# EasyEDA Pro project Влади-проект.eprj

# Schematic Schematic1
Board Name: Board1; Create Date: 2025-12-05; Page Name: P1; Project Name: Влади-проект; Schematic Name: Schematic1; Update Date: 2025-12-05; Company: EasyEDA.com; Page Size: A4; Version: V1.0
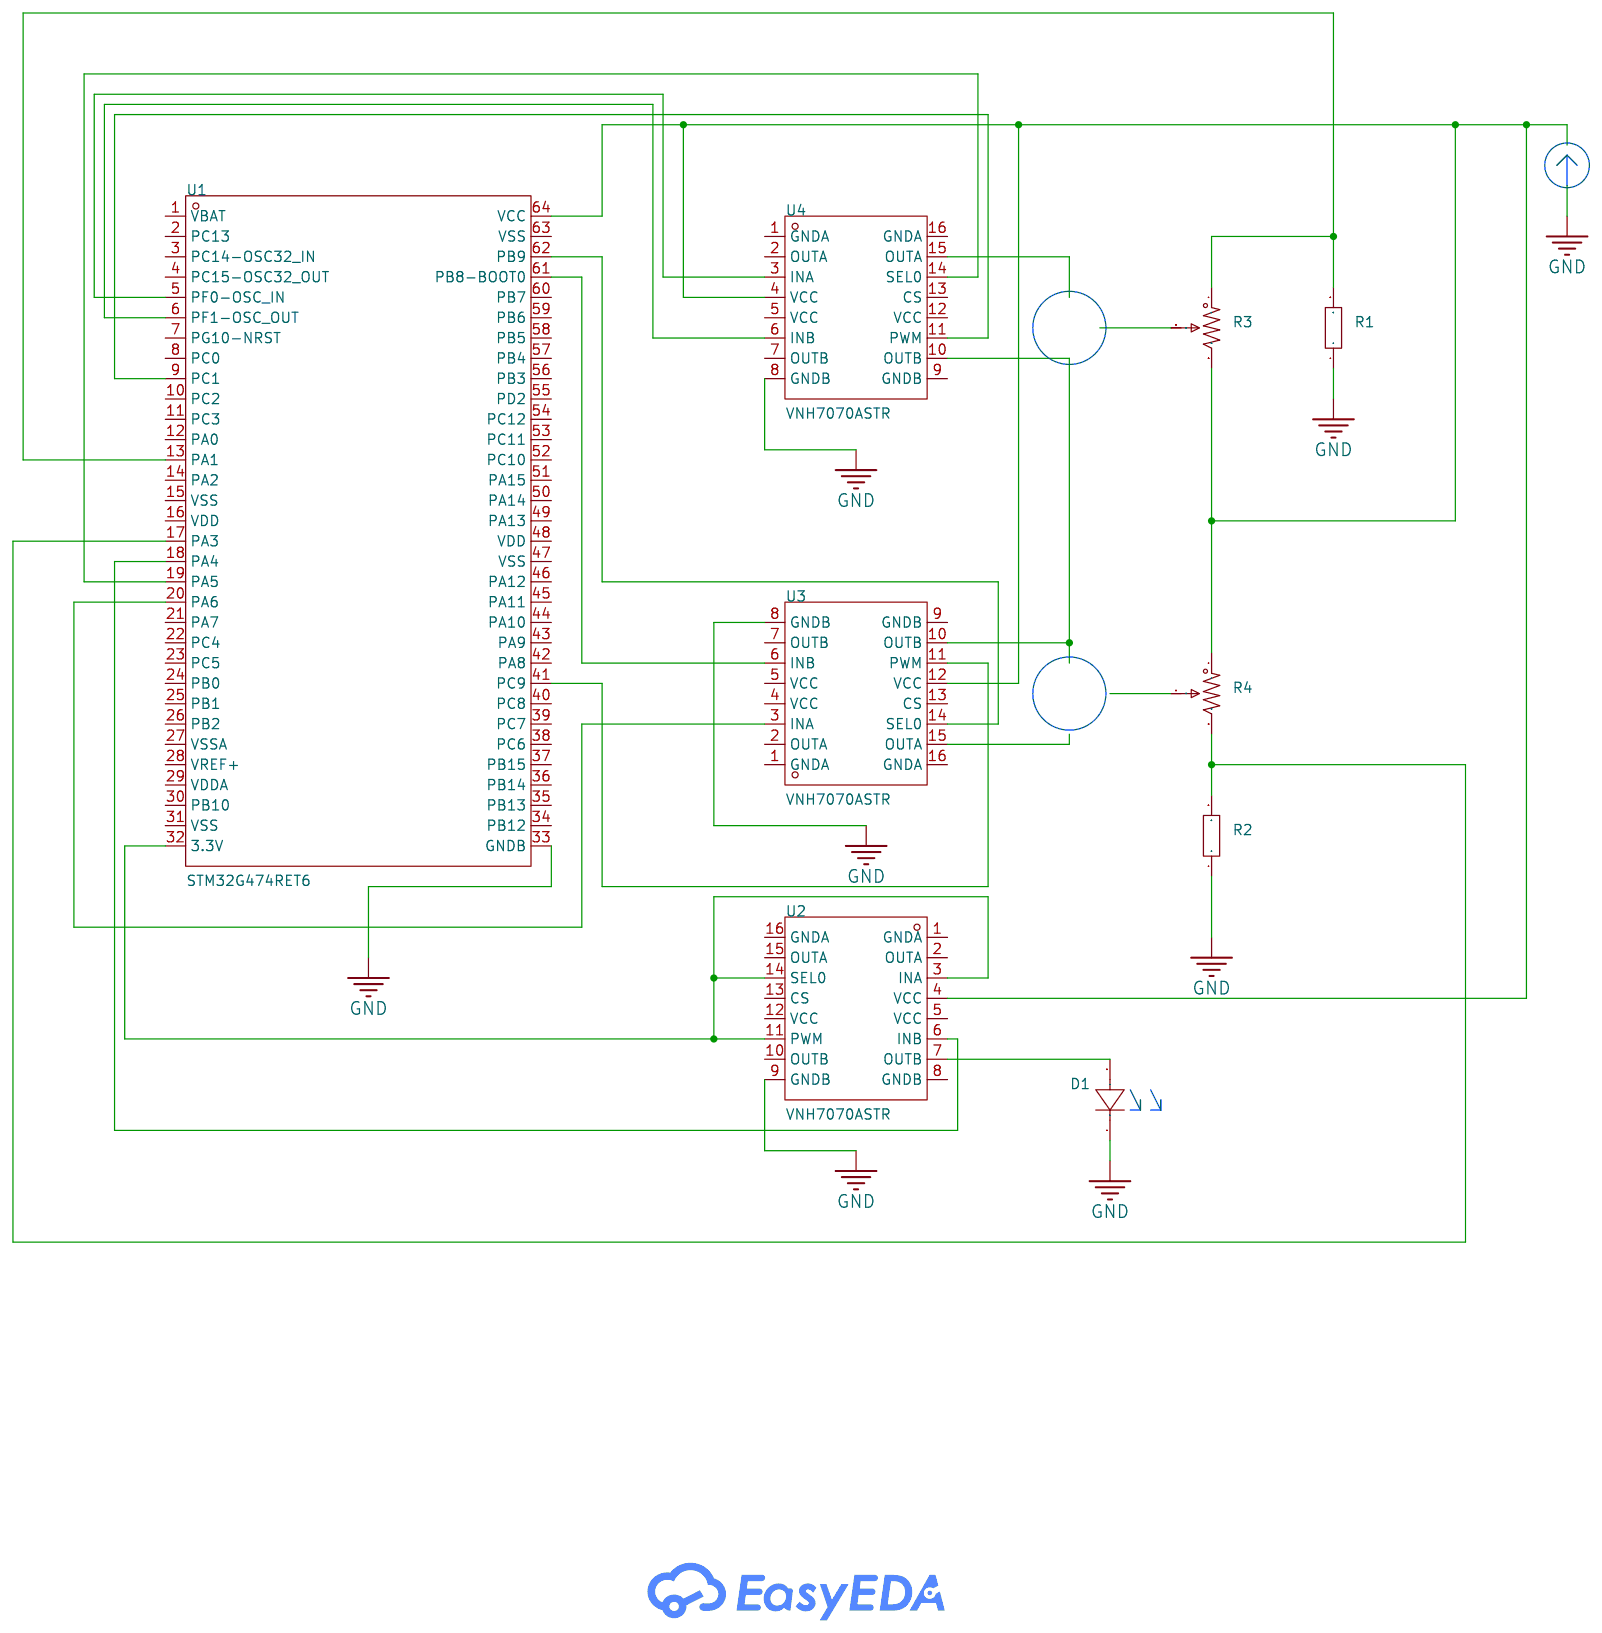
[diagram p0: schematic sheet]

## Parts
D1  -  [SMA_L4.4-W2.8-LS5.4-RD]
R1  10mΩ  [R1206]
R2  10mΩ  [R1206]
R3  10kΩ  [RES-ADJ-TH_3362P]
R4  10kΩ  [RES-ADJ-TH_3362P]
U1  STM32G474RET6  [LQFP-64_L10.0-W10.0-P0.50-LS12.0-BL]
U2  VNH7070ASTR  [SOIC-16_L9.9-W3.9-P1.27-LS6.0-BL]
U3  VNH7070ASTR  [SOIC-16_L9.9-W3.9-P1.27-LS6.0-BL]
U4  VNH7070ASTR  [SOIC-16_L9.9-W3.9-P1.27-LS6.0-BL]

## Library data of the parts
D1 = 1N4007: Supplier Footprint: SMA(DO-214AC); Supplier Part: C727081
R1 R2 = FMF06FTHR010-LH_C105362: Type:Current Sense Resistor Resistance:10mΩ Tolerance:±1% Tolerance:±1% Power(Watts):1W Temperature Coefficient:±70ppm/℃ Temperature Coefficient:±70ppm/℃ Mounting Type:SMD; LCSC Part Name: 10mΩ ±1% 1W 合金电阻; Supplier Part: C105362; Manufacturer: PSA(信昌电陶); Manufacturer Part: FMF06FTHR010-LH; Supplier Footprint: 1206; JLCPCB Part Class: Extended Part; Datasheet: https://item.szlcsc.com/datasheet/FMF06FTHR010-LH/106577.html; Supplier: LCSC; Type: Current Sense Resistor; Tolerance: ±1%; Power(Watts): 1W; Temperature Coefficient: ±70ppm/℃; Mounting Type: SMD
R3 R4 = 3362P-1-103_C118956: Resistance: Tolerance:±10% Tolerance:±10%; LCSC Part Name: 10kΩ ±10%; Supplier Part: C118956; Manufacturer: BOCHEN(博晨); Manufacturer Part: 3362P-1-103; Supplier Footprint: 插件; JLCPCB Part Class: Extended Part; Datasheet: https://atta.szlcsc.com/upload/public/pdf/source/20171114/C118956_15106326650691117445.pdf; Supplier: LCSC; Tolerance: ±10%
U1 = STM32G474RET6: CPU Core:ARM-M4 CPU Maximum Speed:170MHz Program Storage Size:512KB Program Memory Type:FLASH Number of I/O:52 ADC (Bit):12bit DAC (Bit):12bit Voltage - Supply:1.71V~3.6V Voltage - Supply:1.71V~3.6V Applications:-; LCSC Part Name: 带DSP和FPU的170MHz主流ARM Cortex-M4 MCU，具有512 KB Flash存储器、数学加速器、高分辨率定时器和高模拟电平集成; Supplier Part: C521608; Manufacturer: ST(意法半导体); Supplier Footprint: LQFP-64(10x10); JLCPCB Part Class: Extended Part; Datasheet: https://item.szlcsc.com/datasheet/STM32G474RET6/538858.html; Supplier: LCSC; CPU Core: ARM-M4; CPU Maximum Speed: 170MHz; Program Storage Size: 512KB; Program Memory Type: FLASH; Number of I/O: 52; ADC (Bit): 12bit; DAC (Bit): 12bit; Voltage - Supply: 1.71V~3.6V
U2-U4 = VNH7070ASTR: Voltage - Supply:- Voltage - Supply:- Output Current:- Output Current:- RDS(on):70mΩ Operating Temperature:-40℃~+150℃ Operating Temperature:-40℃~+150℃; LCSC Part Name: 15A 有刷直流电机驱动芯片 28V; Supplier Part: C2150622; Manufacturer: ST(意法半导体); Supplier Footprint: SOIC-16; JLCPCB Part Class: Extended Part; Datasheet: https://atta.szlcsc.com/upload/public/pdf/source/20210701/DD84D4DEBD2B1728BCD196DB9C217AB6.pdf; Supplier: LCSC; RDS(on): 70mΩ; Operating Temperature: -40℃~+150℃

## Nets
GND: D1.1(K) R1.1 R2.1 U1.33(GNDB) U2.9(GNDB) U3.8(GNDB) U4.8(GNDB)
Net-(D1-2): D1.2(A) U2.7(OUTB)
Net-(R1-2): R1.2 R3.1 U1.13(PA1)
Net-(R2-2): R2.2 R4.3 U1.17(PA3)
Net-(R3-3): R3.3 R4.1 U1.64(VCC) U2.4(VCC) U3.12(VCC) U4.4(VCC)
Net-(U1-5): U1.5(PF0-OSC_IN) U4.3(INA)
Net-(U1-6): U1.6(PF1-OSC_OUT) U4.6(INB)
Net-(U1-9): U1.9(PC1) U4.11(PWM)
Net-(U1-18): U1.18(PA4) U2.6(INB)
Net-(U1-19): U1.19(PA5) U4.14(SEL0)
Net-(U1-20): U1.20(PA6) U3.3(INA)
Net-(U1-32): U1.32(3.3V) U2.3(INA) U2.11(PWM) U2.14(SEL0)
Net-(U1-41): U1.41(PC9) U3.11(PWM)
Net-(U1-61): U1.61(PB8-BOOT0) U3.6(INB)
Net-(U1-62): U1.62(PB9) U3.14(SEL0)
Net-(U3-10): U3.10(OUTB) U4.10(OUTB)

Not connected (* = marked no-connect by the designer): R3 2; R4 2; U1 1(VBAT) 2(PC13) 3(PC14-OSC32_IN) 4(PC15-OSC32_OUT) 7(PG10-NRST) 8(PC0) 10(PC2) 11(PC3) 12(PA0) 14(PA2) 15(VSS) 16(VDD) 21(PA7) 22(PC4) 23(PC5) 24(PB0) 25(PB1) 26(PB2) 27(VSSA) 28(VREF+) 29(VDDA) 30(PB10) 31(VSS) 34(PB12) 35(PB13) 36(PB14) 37(PB15) 38(PC6) 39(PC7) 40(PC8) 42(PA8) 43(PA9) 44(PA10) 45(PA11) 46(PA12) 47(VSS) 48(VDD) 49(PA13) 50(PA14) 51(PA15) 52(PC10) 53(PC11) 54(PC12) 55(PD2) 56(PB3) 57(PB4) 58(PB5) 59(PB6) 60(PB7) 63(VSS); U2 1(GNDA) 2(OUTA) 5(VCC) 8(GNDB) 10(OUTB) 12(VCC) 13(CS) 15(OUTA) 16(GNDA); U3 1(GNDA) 2(OUTA) 4(VCC) 5(VCC) 7(OUTB) 9(GNDB) 13(CS) 15(OUTA) 16(GNDA); U4 1(GNDA) 2(OUTA) 5(VCC) 7(OUTB) 9(GNDB) 12(VCC) 13(CS) 15(OUTA) 16(GNDA)
